# Altium schematic sheet ADC_Isolation.SchDoc
size A3
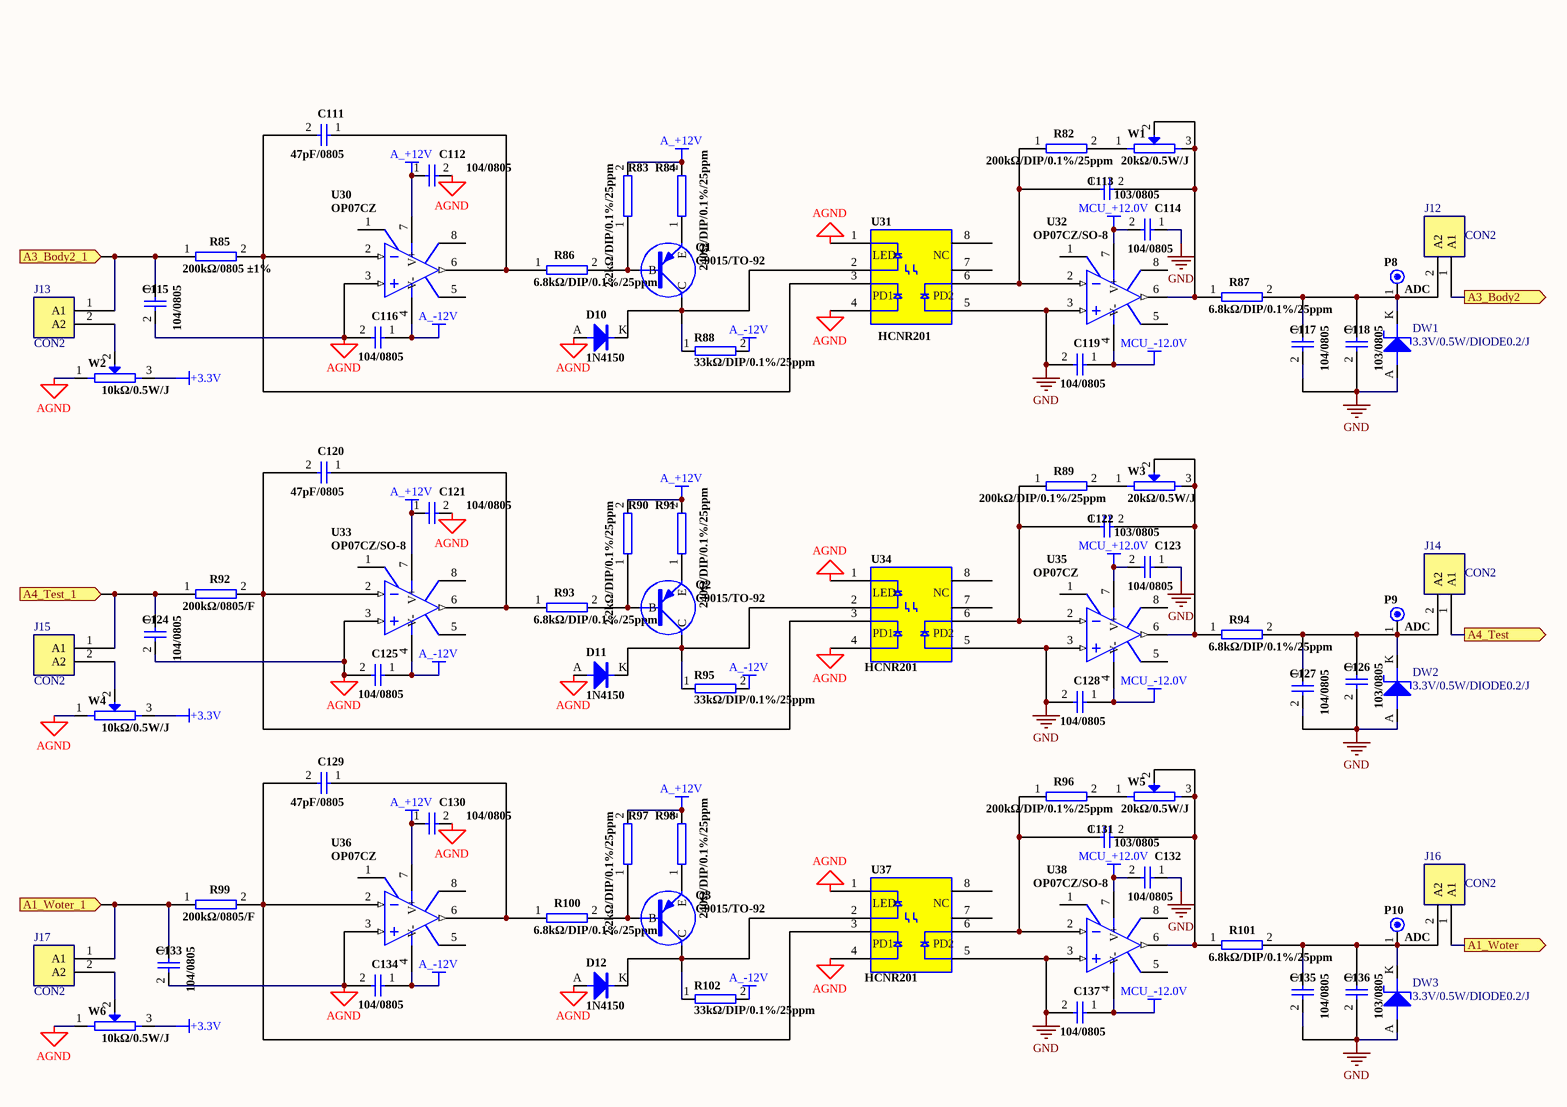
[diagram p0: ADC_Isolation.SchDoc]

## Parts
C111  47pF/0805  [C0805]
C112  104/0805  [C0805]
C113  103/0805  [C0805]
C114  104/0805  [C0805]
C115  104/0805  [C0805]
C116  104/0805  [C0805]
C117  104/0805  [C0805]
C118  103/0805  [C0805]
C119  104/0805  [C0805]
C120  47pF/0805  [C0805]
C121  104/0805  [C0805]
C122  103/0805  [C0805]
C123  104/0805  [C0805]
C124  104/0805  [C0805]
C125  104/0805  [C0805]
C126  103/0805  [C0805]
C127  104/0805  [C0805]
C128  104/0805  [C0805]
C129  47pF/0805  [C0805]
C130  104/0805  [C0805]
C131  103/0805  [C0805]
C132  104/0805  [C0805]
C133  104/0805  [C0805]
C134  104/0805  [C0805]
C135  104/0805  [C0805]
C136  103/0805  [C0805]
C137  104/0805  [C0805]
D10  1N4150  [DIODE0.2]
D11  1N4150  [DIODE0.2]
D12  1N4150  [DIODE0.2]
DW1  3.3V/0.5W/DIODE0.2/J  [DIODE0.2]
DW2  3.3V/0.5W/DIODE0.2/J  [DIODE0.2]
DW3  3.3V/0.5W/DIODE0.2/J  [DIODE0.2]
J12  CON2  [2Pin-2.54]
J13  CON2  [2Pin-2.54]
J14  CON2  [2Pin-2.54]
J15  CON2  [2Pin-2.54]
J16  CON2  [2Pin-2.54]
J17  CON2  [2Pin-2.54]
P8  ADC  [TESTSMD]
P9  ADC  [TESTSMD]
P10  ADC  [TESTSMD]
Q1  C9015/TO-92  [TO-92]
Q2  C9015/TO-92  [TO-92]
Q3  C9015/TO-92  [TO-92]
R82  200kΩ/DIP/0.1%/25ppm  [AXIAL0.4]
R83  2.2kΩ/DIP/0.1%/25ppm  [AXIAL0.4]
R84  240Ω/DIP/0.1%/25ppm  [AXIAL0.4]
R85  200kΩ/0805 ±1%  [R0805]
R86  6.8kΩ/DIP/0.1%/25ppm  [AXIAL0.4]
R87  6.8kΩ/DIP/0.1%/25ppm  [AXIAL0.4]
R88  33kΩ/DIP/0.1%/25ppm  [AXIAL0.4]
R89  200kΩ/DIP/0.1%/25ppm  [AXIAL0.4]
R90  2.2kΩ/DIP/0.1%/25ppm  [AXIAL0.4]
R91  240Ω/DIP/0.1%/25ppm  [AXIAL0.4]
R92  200kΩ/0805/F  [R0805]
R93  6.8kΩ/DIP/0.1%/25ppm  [AXIAL0.4]
R94  6.8kΩ/DIP/0.1%/25ppm  [AXIAL0.4]
R95  33kΩ/DIP/0.1%/25ppm  [AXIAL0.4]
R96  200kΩ/DIP/0.1%/25ppm  [AXIAL0.4]
R97  2.2kΩ/DIP/0.1%/25ppm  [AXIAL0.4]
R98  240Ω/DIP/0.1%/25ppm  [AXIAL0.4]
R99  200kΩ/0805/F  [R0805]
R100  6.8kΩ/DIP/0.1%/25ppm  [AXIAL0.4]
R101  6.8kΩ/DIP/0.1%/25ppm  [AXIAL0.4]
R102  33kΩ/DIP/0.1%/25ppm  [AXIAL0.4]
U30  OP07CZ  [SO-8]
U31  HCNR201  [DIP08W]
U32  OP07CZ/SO-8  [SO-8]
U33  OP07CZ/SO-8  [SO-8]
U34  HCNR201  [DIP08W]
U35  OP07CZ  [SO-8]
U36  OP07CZ  [SO-8]
U37  HCNR201  [DIP08W]
U38  OP07CZ/SO-8  [SO-8]
W1  20kΩ/0.5W/J  [3224W]
W2  10kΩ/0.5W/J  [3224W]
W3  20kΩ/0.5W/J  [3224W]
W4  10kΩ/0.5W/J  [3224W]
W5  20kΩ/0.5W/J  [3224W]
W6  10kΩ/0.5W/J  [3224W]

## Ports
A1_Woter (out), A1_Woter_1 (in), A3_Body2 (out), A3_Body2_1 (in), A4_Test (out), A4_Test_1 (in)

## Nets
+3.3V: W2.3 W4.3 W6.3
A_+12V: C112.1 C121.1 C130.1 R83.2 R84.2 R90.2 R91.2 R97.2 R98.2 U30.7(V+) U33.7(V+) U36.7(V+)
A_-12V: C116.1 C125.1 C134.1 R88.2 R95.2 R102.2 U30.4(V-) U33.4(V-) U36.4(V-)
AGND: C112.2 C115.2 C116.2 C121.2 C124.2 C125.2 C130.2 C133.2 C134.2 D10.A D11.A D12.A U30.3 U31.1 U31.4 U33.3 U34.1 U34.4 U36.3 U37.1 U37.4 W2.1 W4.1 W6.1
GND: C114.1 C117.2 C118.2 C119.2 C123.1 C126.2 C127.2 C128.2 C132.1 C135.2 C136.2 C137.2 DW1.A DW2.A DW3.A U31.5 U32.3 U34.5 U35.3 U37.5 U38.3
MCU_+12.0V: C114.2 C123.2 C132.2 U32.7(V+) U35.7(V+) U38.7(V+)
MCU_-12.0V: C119.1 C128.1 C137.1 U32.4(V-) U35.4(V-) U38.4(V-)
A1_Woter: J16.1(A1) ; port A1_Woter
A1_Woter_1: C133.1 J17.1(A1) R99.1 ; port A1_Woter_1
A3_Body2: J12.1(A1) ; port A3_Body2
A3_Body2_1: C115.1 J13.1(A1) R85.1 ; port A3_Body2_1
A4_Test: J14.1(A1) ; port A4_Test
A4_Test_1: C124.1 J15.1(A1) R92.1 ; port A4_Test_1
NetC111_1: C111.1 R86.1 U30.6
NetC111_2: C111.2 R85.2 U30.2 U31.3
NetC113_1: C113.1 R82.1 U31.6 U32.2
NetC113_2: C113.2 R87.1 U32.6 W1.2 W1.3
NetC117_1: C117.1 C118.1 DW1.K J12.2(A2) P8.1 R87.2
NetC120_1: C120.1 R93.1 U33.6
NetC120_2: C120.2 R92.2 U33.2 U34.3
NetC122_1: C122.1 R89.1 U34.6 U35.2
NetC122_2: C122.2 R94.1 U35.6 W3.2 W3.3
NetC126_1: C126.1 C127.1 DW2.K J14.2(A2) P9.1 R94.2
NetC129_1: C129.1 R100.1 U36.6
NetC129_2: C129.2 R99.2 U36.2 U37.3
NetC131_1: C131.1 R96.1 U37.6 U38.2
NetC131_2: C131.2 R101.1 U38.6 W5.2 W5.3
NetC135_1: C135.1 C136.1 DW3.K J16.2(A2) P10.1 R101.2
NetD10_K: D10.K Q1.3(C) R88.1 U31.2
NetD11_K: D11.K Q2.3(C) R95.1 U34.2
NetD12_K: D12.K Q3.3(C) R102.1 U37.2
NetJ13_2: J13.2(A2) W2.2
NetJ15_2: J15.2(A2) W4.2
NetJ17_2: J17.2(A2) W6.2
NetQ1_1: Q1.1(B) R83.1 R86.2
NetQ1_2: Q1.2(E) R84.1
NetQ2_1: Q2.1(B) R90.1 R93.2
NetQ2_2: Q2.2(E) R91.1
NetQ3_1: Q3.1(B) R97.1 R100.2
NetQ3_2: Q3.2(E) R98.1
NetR82_2: R82.2 W1.1
NetR89_2: R89.2 W3.1
NetR96_2: R96.2 W5.1

Not connected (* = marked no-connect by the designer): U30 1 5 8; U31 7 8; U32 1 5 8; U33 1 5 8; U34 7 8; U35 1 5 8; U36 1 5 8; U37 7 8; U38 1 5 8

## Notes on the sheet
- (in symbol HCNR201) LED; NC; PD1; PD2

## Library data of the parts
C111 C120 C129 = CAP: 贴片电容 47pF/25V ±1% C0805
C112 C114-C117 C119 C121 C123-C125 C127 C128 C130 C132-C135 C137 = CAP: 贴片电容 104/25V ±1% C0805
C113 C118 C122 C126 C131 C136 = CAP: 贴片电容 103/25V ±1% C0805
D10-D12 = DIODE0: 快速开关二极管 1N415050V 450mA/J /DIODE0.2
DW1-DW3 = ZENER0: 稳压二极管 3.3V/0.5W/DIODE0.2/J
J12-J17 = CON2: 单排排针（2针）2.54mm 2Pin-2.54
P8-P10 = CON1
Q1-Q3 = PNP: 三极管 C9015 TO-92
R82 R89 R96 = RES2: 高精度电阻 200kΩ DIP ±0.1% 25ppm AXIAL0.4
R83 R90 R97 = RES2: 高精度电阻 2.2kΩ DIP ±0.1% 25ppm AXIAL0.4
R84 R91 R98 = RES2: 高精度电阻 240Ω DIP ±0.1% 25ppm AXIAL0.4
R85 R92 R99 = RES2: 贴片电阻 200kΩ 0.25W ±1% R0805
R86 R87 R93 R94 R100 R101 = RES2: 高精度电阻 6.8kΩ DIP ±0.1% 25ppm AXIAL0.4
R88 R95 R102 = RES2: 高精度电阻 33kΩ DIP ±0.1% 25ppm AXIAL0.4
U30 U32 U33 U35 U36 U38 = OP07CZ: 运算放大器 OP07CZ SO-8
U31 U34 U37 = HCNR201: 线性光耦隔离器 HCNR201 DIP08W
W1 W3 W5 = RPOT: 高精密可调电位器 20kΩ/0.5W/J  3224W
W2 W4 W6 = RPOT: 高精密可调电位器 10kΩ/0.5W/J  3224W